# Altium schematic sheet Data_Conversion_BottomBoard.SchDoc
size A
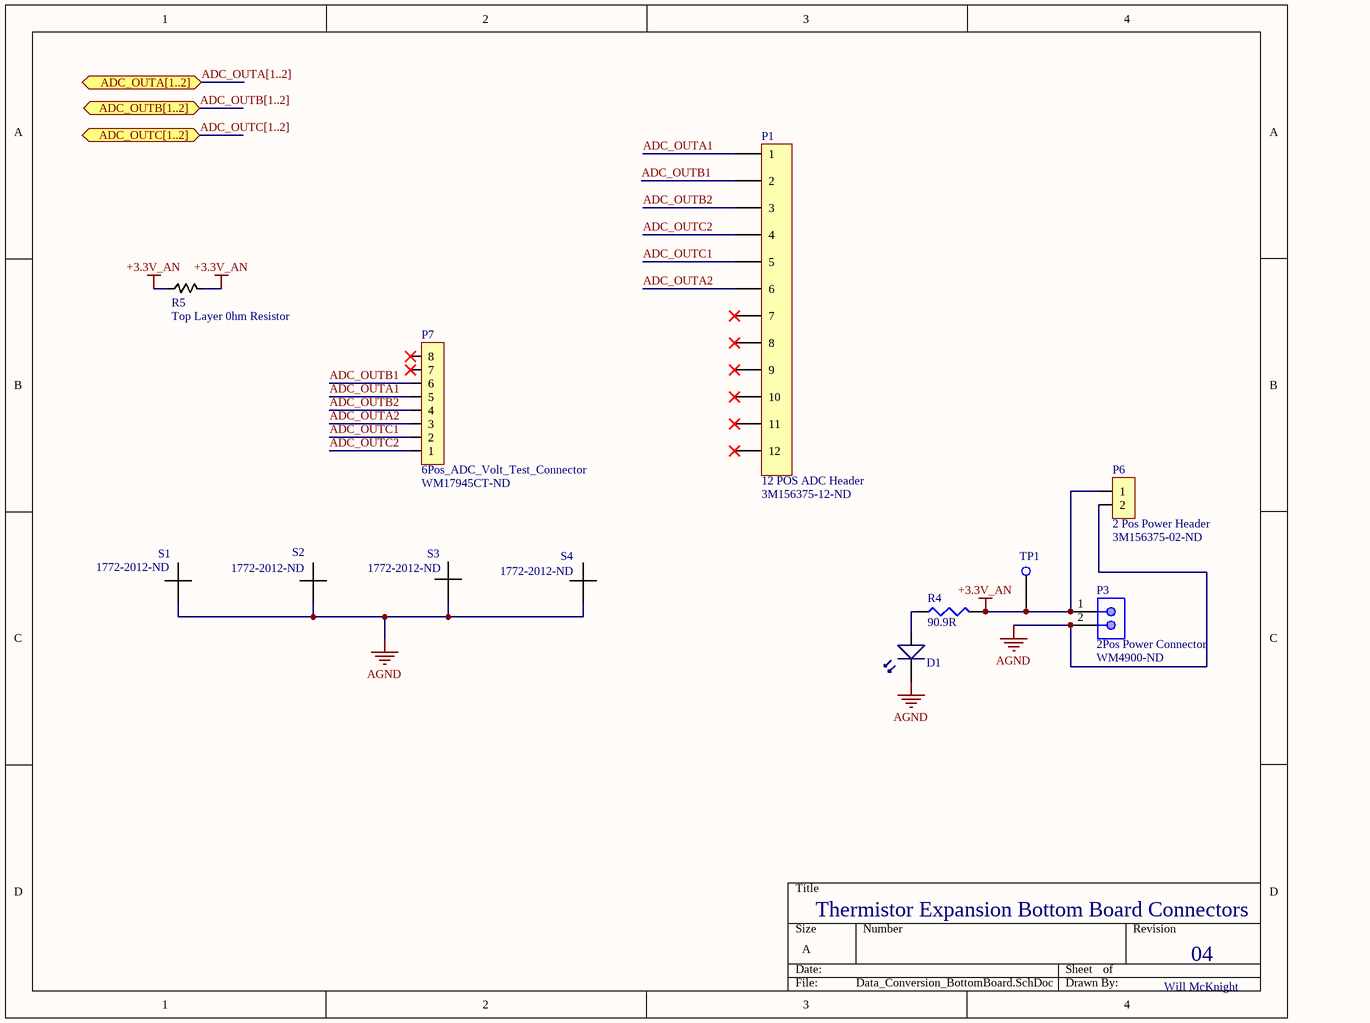
[diagram p0: Data_Conversion_BottomBoard.SchDoc]

## Parts
D1  LED  [Green_SMD_LED]  (value not drawn)
P1  12 POS ADC Header  Supplier Part Number 1: 3M156375-12-ND  [12 POS Dual Header]
P3  2Pos Power Connector  Supplier Part Number 1: WM4900-ND  [2Pos Power Connector]
P6  2 Pos Power Header  Supplier Part Number 1: 3M156375-02-ND  [2 POS Power Header]
P7  6Pos_ADC_Volt_Test_Connector  Supplier Part Number 1: WM17945CT-ND  [6POS_ADC_Volt_TEST]
R4  Resistance: 90.9R  [Green_LED_Resistor_90.9]  (hidden comment: Green)
R5  Top Layer 0hm Resistor  [Top Layer 0ohm Resistor]
S1  Supplier Part Number 1: 1772-2012-ND  [#6-32 Female-Male Standoff]  (hidden comment: #6-32 Female-Male Standoff)
S2  Supplier Part Number 1: 1772-2012-ND  [#6-32 Female-Male Standoff]  (hidden comment: #6-32 Female-Male Standoff)
S3  Supplier Part Number 1: 1772-2012-ND  [#6-32 Female-Male Standoff]  (hidden comment: #6-32 Female-Male Standoff)
S4  Supplier Part Number 1: 1772-2012-ND  [#6-32 Female-Male Standoff]  (hidden comment: #6-32 Female-Male Standoff)
TP1  Test Point  [Test Point]  (value not drawn)

## Ports
ADC_OUTA[1..2] (bidir), ADC_OUTB[1..2] (bidir), ADC_OUTC[1..2] (bidir)

## Nets
+3.3V_AN: P3.1 P6.1 R4.2 R5.1 R5.2 TP1.1
AGND: D1.1 P3.2 P6.2 S1.1 S2.1 S3.1 S4.1
ADC_OUTA1: P1.1 P7.5
ADC_OUTA2: P1.6 P7.3
ADC_OUTB1: P1.2 P7.6
ADC_OUTB2: P1.3 P7.4
ADC_OUTC1: P1.5 P7.2
ADC_OUTC2: P1.4 P7.1
NetD1_2: D1.2 R4.1

Not connected (* = marked no-connect by the designer): P1 7* 8* 9* 10* 11* 12*; P7 7* 8*

## Buses and harness runs
bus ADC_OUTA[1..2] = port ADC_OUTA[1..2]
bus ADC_OUTB[1..2] = port ADC_OUTB[1..2]
bus ADC_OUTC[1..2] = port ADC_OUTC[1..2]

## Notes on the sheet
- Thermistor Expansion Bottom Board Connectors
- 04
- Will McKnight

## Library data of the parts
D1 = GREEN_LED: Manufacturer: Dialight; Manufacturer Part Number: 5988070107F; Color: Green; Lens Color: Colorless,Clear; Forward Voltage: 2V; Forward Current: 20mA; Wavelength: 570nm; Luminous Intensity: 20mcd; Viewing Angle: 140°; Lens Style: Flat,Rectangular,Diffused,Colorless,Clear; Dominant Wavelength: 568nm; Number of Elements: 1; Power Dissipation: 60mW; Reverse Voltage: 5V; Lens Transparency: Clear; Lens Size: 0.8mm; Supplier 1: Digi-Key; Stock 1: 228546; Pricing 1: 1=0.46, 10=0.33, 25=0.2528, 100=0.1648, 250=0.1209, 500=0.1026, 1000=0.0843 (USD); Mount: Surface Mount; Case/Package: 0603; Number of Pins: 2; Case Code (Metric): 1608; Case Code (Imperial): 0603; Min Operating Temperature: -30°C; Max Operating Temperature: 100°C; Package Quantity: 4000; Packaging: Tape and Reel; Illumination Color: Green; Test Current: 20mA; Number of LEDs: 1; Length: 1.6mm; Height: 0.7mm; Depth: 0.8mm; Width: 0.8mm; Radiation Hardening: No; Lead Free: Lead Free; REACH SVHC: No SVHC; ComponentLink1URL: http://www.mouser.com/ds/2/109/SMT_selector_guide-267443.pdf?src-supplier=Mouser; ComponentLink1Description: http://www.mouser.com/ds/2/109/SMT_selector_guide-267443.pdf?src-supplier=Mouser; ComponentLink2URL: http://uk.rs-online.com/webdocs/0ae2/0900766b80ae2975.pdf?src-supplier=RSComponents; ComponentLink2Description: http://uk.rs-online.com/webdocs/0ae2/0900766b80ae2975.pdf?src-supplier=RSComponents; ComponentLink3URL: http://www.farnell.com/datasheets/1720200.pdf?src-supplier=Element14; ComponentLink3Description: http://www.farnell.com/datasheets/1720200.pdf?src-supplier=Element14; ComponentLink4URL: https://media.digikey.com/pdf/Data%20Sheets/Dialight%20PDFs/598_Series_0603_Pkg.pdf?src-supplier=Digi-Key; ComponentLink4Description: https://media.digikey.com/pdf/Data%20Sheets/Dialight%20PDFs/598_Series_0603_Pkg.pdf?src-supplier=Digi-Key; ComponentLink5URL: http://www.farnell.com/datasheets/1484480.pdf?src-supplier=Element14; ComponentLink5Description: http://www.farnell.com/datasheets/1484480.pdf?src-supplier=Element14; ComponentLink6URL: https://www.alliedelec.com/m/d/745256ca487aea7b70ea31e2d673d5bb.pdf?src-supplier=Allied+Electronics; ComponentLink6Description: https://www.alliedelec.com/m/d/745256ca487aea7b70ea31e2d673d5bb.pdf?src-supplier=Allied+Electronics; ComponentLink7URL: http://www.onlinecomponents.com/productFiles/mf-DIA/mdei5980603.pdf?src-supplier=Onlinecomponents.com; ComponentLink7Description: http://www.onlinecomponents.com/productFiles/mf-DIA/mdei5980603.pdf?src-supplier=Onlinecomponents.com; ComponentLink8URL: https://www.verical.com/server-webapp/html/getDatasheet?partID=146438&src-supplier=Verical; ComponentLink8Description: https://www.verical.com/server-webapp/html/getDatasheet?partID=146438&src-supplier=Verical; ComponentLink9URL: http://www.dialight.com/Assets/Brochures_And_Catalogs/Indication/SMT_selector_guide.pdf?src-supplier=Future+Electronics; ComponentLink9Description: http://www.dialight.com/Assets/Brochures_And_Catalogs/Indication/SMT_selector_guide.pdf?src-supplier=Future+Electronics; Supplier Part Number 1: 350-2035-1-ND
P1 = 12 POS ADC Header: Interboard connector for thermistors connecting to ADC; Manufacturer: 3M; Manufacturer Part Number: 929715-06-06-EU; Number of Positions: 12; Connector Type: Male Pin; Gender: Male; Pitch: 0.1inch; Supplier 1: Digi-Key; Stock 1: 0; Pricing 1: 1=1.86000, 10=1.69000, 25=1.58600, 50=1.51720, 100=1.44820, 250=1.31024, 500=1.20680 (USD); RoHS: Yes; Mount: Through Hole; Contact Plating: Gold; Color: Black; Number of Rows: 2; Packaging: Bulk; Termination: Solder; Package Quantity: 500; Row Spacing: 0.1inch; Contact Mating Length: 0.318inch; ComponentLink1URL: http://www.mouser.com/ds/2/1/ts0769-35914.pdf?src-supplier=Mouser; ComponentLink1Description: http://www.mouser.com/ds/2/1/ts0769-35914.pdf?src-supplier=Mouser; ComponentLink2URL: http://components.arrow.com/part/dataview/42715320S8912076N3321?src-supplier=Arrow; ComponentLink2Description: http://components.arrow.com/part/dataview/42715320S8912076N3321?src-supplier=Arrow; ComponentLink3URL: http://multimedia.3m.com/mws/mediawebserver?66666UuZjcFSLXTtmXME5x46EVuQEcuZgVs6EVs6E666666--?src-supplier=Digi-Key; ComponentLink3Description: http://multimedia.3m.com/mws/mediawebserver?66666UuZjcFSLXTtmXME5x46EVuQEcuZgVs6EVs6E666666--?src-supplier=Digi-Key; System: Connector
P3 = 2Pos Power Connector: Headers & Wire Housings R/A HDR 2P low profile single; Manufacturer: Molex; Manufacturer Part Number: 70553-0001; Current Rating: 3A; Voltage Rating: 250V; Contact Resistance: 30mR; Number of Positions: 2; Gender: Male; Insulation Resistance: 1GR; Pitch: 2.54mm; Approvals: UL; Glow Wire Compliant: Non-compliant; Supplier 1: Digi-Key; Stock 1: 8671; Pricing 1: 1=0.71000, 72=0.53486, 144=0.51264, 504=0.44575, 1008=0.36775, 5040=0.32318, 10008=0.30089 (USD); RoHS: Yes; Mount: Through Hole; Contact Material: Bronze; Contact Plating: Gold; Color: Black; Housing Color: Black; Material: Brass; Housing Material: Thermoplastic; Min Operating Temperature: -40°C; Max Operating Temperature: 105°C; Package Quantity: 2880; Number of Rows: 1; Packaging: Rail/Tube; Termination: Through Hole; Number of Contacts: 2; Orientation: Right Angle; Number of Circuits: 2; Voltage Rating (DC): 250V; Radiation Hardening: No; REACH SVHC: Unknown; Lead Free: Lead Free; Flammability Rating: UL94 V-0; ELV: Compliant; ComponentLink1URL: https://datasheet.ciiva.com/5158/0705530001-pcb-headers-172944-5158768.pdf?src-supplier=Mouser; ComponentLink1Description: https://datasheet.ciiva.com/5158/0705530001-pcb-headers-172944-5158768.pdf?src-supplier=Mouser; ComponentLink2URL: https://datasheet.ciiva.com/11746/0900766b80d8d649-11746625.pdf?src-supplier=RSComponents; ComponentLink2Description: https://datasheet.ciiva.com/11746/0900766b80d8d649-11746625.pdf?src-supplier=RSComponents; ComponentLink3URL: https://datasheet.ciiva.com/16657/0705530001-pcb-headers-16657777.pdf?src-supplier=Avnet+Europe; ComponentLink3Description: https://datasheet.ciiva.com/16657/0705530001-pcb-headers-16657777.pdf?src-supplier=Avnet+Europe; ComponentLink4URL: https://datasheet.ciiva.com/7920/ps-70541-7920854.pdf?src-supplier=Element14; ComponentLink4Description: https://datasheet.ciiva.com/7920/ps-70541-7920854.pdf?src-supplier=Element14; ComponentLink5URL: https://datasheet.ciiva.com/30195/179180705530001-pcb-headers-30195548.pdf?src-supplier=Onlinecomponents.com; ComponentLink5Description: https://datasheet.ciiva.com/30195/179180705530001-pcb-headers-30195548.pdf?src-supplier=Onlinecomponents.com; ComponentLink6URL: https://datasheet.ciiva.com/1438/1887076-1438989.pdf?src-supplier=Element14; ComponentLink6Description: https://datasheet.ciiva.com/1438/1887076-1438989.pdf?src-supplier=Element14; ComponentLink7URL: https://datasheet.ciiva.com/10090/0705530001-pcb-headers-10090317.pdf?src-supplier=Avnet; ComponentLink7Description: https://datasheet.ciiva.com/10090/0705530001-pcb-headers-10090317.pdf?src-supplier=Avnet
P6 = 2 Pos Power Header: Manufacturer: 3M; Manufacturer Part Number: 929715-06-01-EU; Gender: Male; Number of Positions: 2; Connector Type: Male Pin; Current Rating: 2.5A; Pitch: 2.54mm; Row Spacing: 0.1inch; Supplier 1: Digi-Key; Stock 1: 0; Pricing 1: 1=0.43000, 10=0.40200, 25=0.34480, 50=0.29300, 100=0.28160, 250=0.25284, 500=0.24136 (USD); RoHS: Yes; Mount: Through Hole; Contact Plating: Gold; Color: Black; Contact Material: Copper Alloy; Housing Material: Polycyclohexylenedimethylene; Min Operating Temperature: -40°C; Max Operating Temperature: 105°C; Number of Rows: 2; Packaging: Bulk; Termination: Solder; Package Quantity: 1000; Contact Gender: Male; Contact Mating Length: 0.318inch; ComponentLink1URL: https://datasheet.ciiva.com/5147/ts0769-35914-5147696.pdf?src-supplier=Mouser; ComponentLink1Description: https://datasheet.ciiva.com/5147/ts0769-35914-5147696.pdf?src-supplier=Mouser; ComponentLink2URL: https://datasheet.ciiva.com/6818/ts0769-6818155.pdf?src-supplier=Digi-Key; ComponentLink2Description: https://datasheet.ciiva.com/6818/ts0769-6818155.pdf?src-supplier=Digi-Key
P7 = 6Pos_ADC_Volt_Test_Connector: Connector Header Surface Mount, Right Angle 6 position 0.079" (2.00mm); Manufacturer: Molex; Manufacturer Part Number: 5055780671; Supplier 1: Digi-Key; Stock 1: 3435; Pricing 1: 1=1.02000, 10=0.89300, 100=0.77050 (USD); RoHS: No
R4 = Green_LED_Res: Manufacturer: Panasonic; Manufacturer Part Number: ERJ-1GNF90R9C; Power Rating: 50mW; Tolerance: 1%; Voltage Rating: 25V; Temperature Coefficient: 200ppm/°C; Voltage Rating (DC): 50V; Mount: Surface Mount; Case/Package: 0201; Case Code (Imperial): 0201; Case Code (Metric): 0603; Contact Plating: Tin,Matte; Min Operating Temperature: -55°C; Max Operating Temperature: 125°C; Package Quantity: 15000; Packaging: Tape and Reel; Composition: Thick Film; Number of Terminations: 2; Max Power Dissipation: 50mW; Termination: SMD/SMT; Length: 0.024inch; Height: 0.01inch; Width: 0.3mm; Radiation Hardening: No; Supplier 1: Digi-Key; Stock 1: 401780; Pricing 1: 1=0.10000, 10=0.02400, 100=0.00970, 1000=0.00437, 2500=0.00379 (USD); RoHS: Yes; Military Standard: Not; Depth: 0.8mm; Lead Free: Lead Free; ComponentLink1URL: https://datasheet.ciiva.com/15189/getdatasheetpartid-326528-15189836.pdf?src-supplier=Verical; ComponentLink1Description: https://datasheet.ciiva.com/15189/getdatasheetpartid-326528-15189836.pdf?src-supplier=Verical; ComponentLink2URL: https://datasheet.ciiva.com/12558/rc0603-272842-12558285.pdf?src-supplier=Mouser; ComponentLink2Description: https://datasheet.ciiva.com/12558/rc0603-272842-12558285.pdf?src-supplier=Mouser; Supplier Part Number 1: 311-90.9HRCT-ND
S1-S4 = #6-32 Female-Male Standoff: Hex Standoff Threaded #6-32 Aluminum 0.375" (9.53mm) 3/8"; Manufacturer: RAF; Manufacturer Part Number: 4532-632-AL-7; Plating: Iridite; Gender: Male to Female; System: Connector; Supplier 1: Digi-Key; Stock 1: 6226; Pricing 1: 1=0.43000, 25=0.28720, 100=0.24440, 250=0.23220, 500=0.21996, 1000=0.20774 (USD); RoHS: Yes; Mount: Hardware; Case/Package: Aluminum; Material: Aluminium; Shape: Hex; Packaging: Bulk; Package Quantity: 100; Length: 0.375inch; REACH SVHC: Unknown; ComponentLink1URL: https://datasheet.ciiva.com/7374/1232651-7374258.pdf?src-supplier=Newark; ComponentLink1Description: https://datasheet.ciiva.com/7374/1232651-7374258.pdf?src-supplier=Newark; ComponentLink2URL: https://datasheet.ciiva.com/5226/4532-632-al-7-198196-5226842.pdf?src-supplier=Mouser; ComponentLink2Description: https://datasheet.ciiva.com/5226/4532-632-al-7-198196-5226842.pdf?src-supplier=Mouser; ComponentLink3URL: https://datasheet.ciiva.com/7921/1232651-7921382.pdf?src-supplier=Element14; ComponentLink3Description: https://datasheet.ciiva.com/7921/1232651-7921382.pdf?src-supplier=Element14